# Altium schematic sheet 7_Sensitivity.SchDoc
size A4; SheetNumber: 1; SheetTotal: 1; SPICEModelCacheCSPBSJPQ: <root> / <DocumentId>CSPBSJPQ</DocumentId> / <CacheFrame Number="0"> / <Model Name="bc846" Kind="MDL"> / <Text>.MODEL BC846 NPN(  BF=324.4 BR=8.29 CJC=3.347E-12 CJE=1.244E-11 FC=0.979 IKF=0.109 IKR=0.09 IRB=5E-06 IS=1.822E-14 ISC=9.982E-12 ISE=2.894E-16 ITF=0.3131 MJC=0.391 MJE=0.3656 MJS=0.333 NC=1.763 NE=1.4 NF=0.9932 NK=500M NR=0.9931 RB=10 RBM=5 RC=0.7014 RE=0.649 TF=4.908E-10 TR=9E-08 VAF=82 VAR=17.9 VJC=0.5463 VJE=0.7579 VTF=2.927 XCJC=0.6193 XTF=9.51 )</Text> / </Model> / </CacheFrame> / </root>
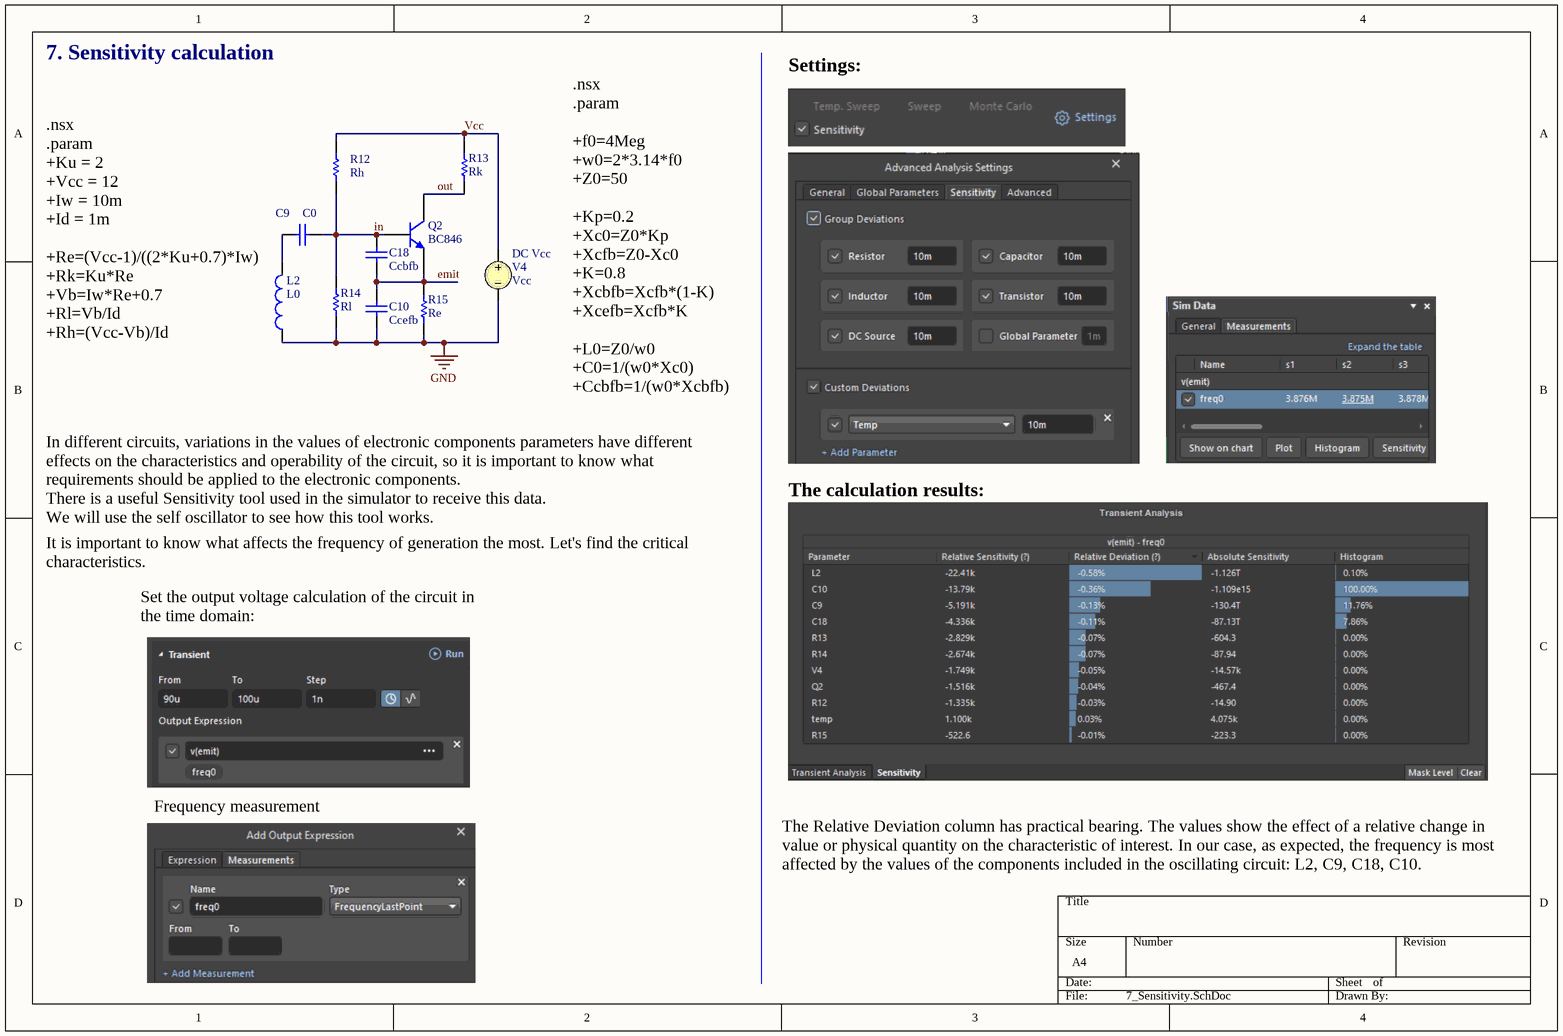
[diagram p0: 7_Sensitivity.SchDoc]

## Parts
C9  value C0  (hidden comment: Capacitor)
C10  value Ccefb  (hidden comment: Capacitor)
C18  value Ccbfb  (hidden comment: Capacitor)
L2  value L0  (hidden comment: Inductor)
Q2  BC846  [TO-92A]
R12  value Rh  (hidden comment: Resistor)
R13  value Rk  (hidden comment: Resistor)
R14  value Rl  (hidden comment: Resistor)
R15  value Re  (hidden comment: Resistor)
V4  DC Vcc  value Vcc

## Nets
GND: C10.1 L2.1 R14.2 R15.1 V4.2
emit: C10.2 C18.1 Q2.1(E) R15.2
in: C9.2 C18.2 Q2.2(B) R12.1 R14.1
out: Q2.3(C) R13.1
Vcc: R12.2 R13.2 V4.1
NetC9_1: C9.1 L2.2

## Notes on the sheet
- 7. Sensitivity calculation
- Settings:
- (near L2) .nsx
  .param
  +Ku = 2
  +Vcc = 12
  +Iw = 10m
  +Id = 1m
  +Re=(Vcc-1)/((2*Ku+0.7)*Iw)
  +Rk=Ku*Re
  +Vb=Iw*Re+0.7
  +Rl=Vb/Id
  +Rh=(Vcc-Vb)/Id
- .nsx
  .param
  +f0=4Meg
  +w0=2*3.14*f0
  +Z0=50
  +Kp=0.2
  +Xc0=Z0*Kp
  +Xcfb=Z0-Xc0
  +K=0.8
  +Xcbfb=Xcfb*(1-K)
  +Xcefb=Xcfb*K
  +L0=Z0/w0
  +C0=1/(w0*Xc0)
  +Ccbfb=1/(w0*Xcbfb)
  +Ccefb=1/(w0*Xcefb)
- In different circuits, variations in the values of electronic components parameters have different effects on the characteristics and operability of the circuit, so it is important to know what requirements should be applied to the electronic components.
  There is a useful Sensitivity tool used in the simulator to receive this data.
  We will use the self oscillator to see how this tool works.
- The calculation results:
- It is important to know what affects the frequency of generation the most. Let's find the critical characteristics.
- Set the output voltage calculation of the circuit in the time domain:
- Frequency measurement
- The Relative Deviation column has practical bearing. The values show the effect of a relative change in value or physical quantity on the characteristic of interest. In our case, as expected, the frequency is most affected by the values of the components included in the oscillating circuit: L2, C9, C18, C10.

## Library data of the parts
C9 C10 C18 = Capacitor: SimulationGenericComponent: True
L2 = Inductor: SimulationGenericComponent: True
Q2 = 2N3904: NPN General Purpose Amplifier; Published: 8-Jun-2000; LatestRevisionDate: 15-Jan-2003; LatestRevisionNote: PCB Footprint 'BCY-W3/D4.7' replaced; DatasheetVersion: 1997; PackageVersion: Sep-1998; PackageReference: TO-92A; Publisher: Altium Limited; PackageDescription: TO, Flat Index; 3 In-Line, Axial Leads; Body Dia. 4.5mm; Leads 0.51 x 0.48 mm (max); ComponentLink1Description: Manufacturer Link; ComponentLink1URL: http://www.fairchildsemi.com/; ComponentLink2Description: Datasheet; ComponentLink2URL: http://www.fairchildsemi.com/ds/2N%2F2N3904.pdf
V4 = VSRC: Voltage Source; Note: PCB Footprint - Not required; AC Magnitude: 0; Published: 30-July-2020; LatestRevisionDate: 30-July-2020; LatestRevisionNote: Re-released for DXP Platform.; PackageReference: Not Applicable; Publisher: Altium Limited